# EAGLE design pcb_transformer_test (EAGLE 9.2.2)
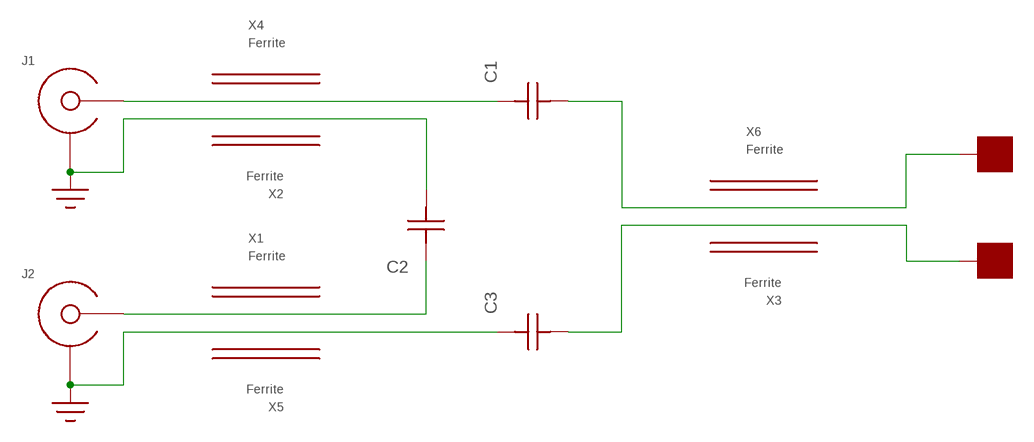
[diagram p0: schematic, sheet 1]

## Parts
C1  C0603  [C0603]
C2  C0603  [C0603]
C3  C0603  [C0603]
J1  EDGE_LAUNCH_JACK  [EDGE_LAUNCH_RF_CON]
J2  EDGE_LAUNCH_JACK  [EDGE_LAUNCH_RF_CON]
U$2  PAD50MIL  [PAD_50MIL]
U$5  PAD50MIL  [PAD_50MIL]
X1  Ferrite  FERRITE_PLATE  [FERRITE-MP0350]
X2  Ferrite  FERRITE_PLATE  [FERRITE-MP0350]
X3  Ferrite  FERRITE_PLATE  [FERRITE-MP0350]
X4  Ferrite  FERRITE_PLATE  [FERRITE-MP0350]
X5  Ferrite  FERRITE_PLATE  [FERRITE-MP0350]
X6  Ferrite  FERRITE_PLATE  [FERRITE-MP0350]

## Nets
GND: C2.P$1 C3.P$2 J1.GND@1(SHIELD) J1.GND@2(SHIELD) J1.GND@3(SHIELD) J1.GND@4(SHIELD) J1.GND@5(SHIELD) J1.GND@6(SHIELD) J1.GND@7(SHIELD) J1.GND@8(SHIELD) J1.GND@9(SHIELD) J1.GND@10(SHIELD) J1.GND@11(SHIELD) J1.GND@12(SHIELD) J1.SHIELD@1(SHIELD) J1.SHIELD@2(SHIELD) J2.GND@1(SHIELD) J2.GND@2(SHIELD) J2.GND@3(SHIELD) J2.GND@4(SHIELD) J2.GND@5(SHIELD) J2.GND@6(SHIELD) J2.GND@7(SHIELD) J2.GND@8(SHIELD) J2.GND@9(SHIELD) J2.GND@10(SHIELD) J2.GND@11(SHIELD) J2.GND@12(SHIELD) J2.SHIELD@1(SHIELD) J2.SHIELD@2(SHIELD)
N$1: C1.P$2 J1.CENTER
N$2: C2.P$2 J2.CENTER
N$3: C1.P$1 U$2.P$1
N$4: C3.P$1 U$5.P$1

## Library data of the parts
C1-C3 = yapo:C
J1 J2 = yapo:EDGE_LAUNCH_JACK
U$2 U$5 = yapo:PAD
X1-X6 = yapo:FERRITE_PLATE

## Board
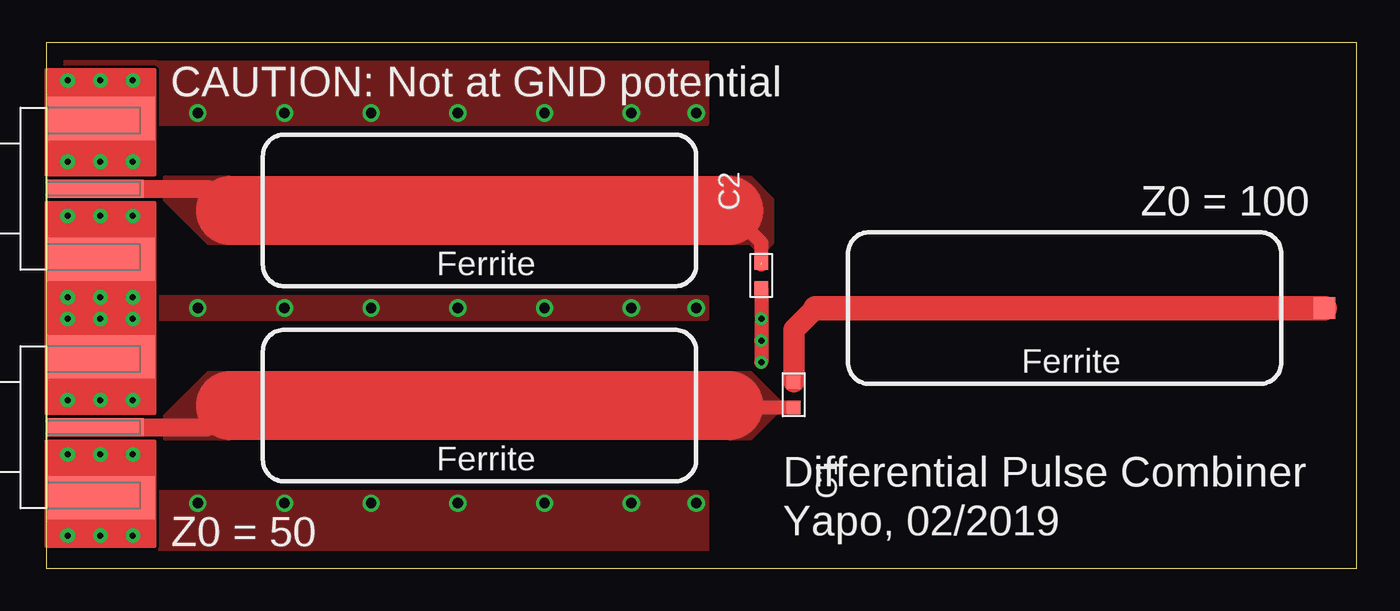
[diagram p1: board, top side]
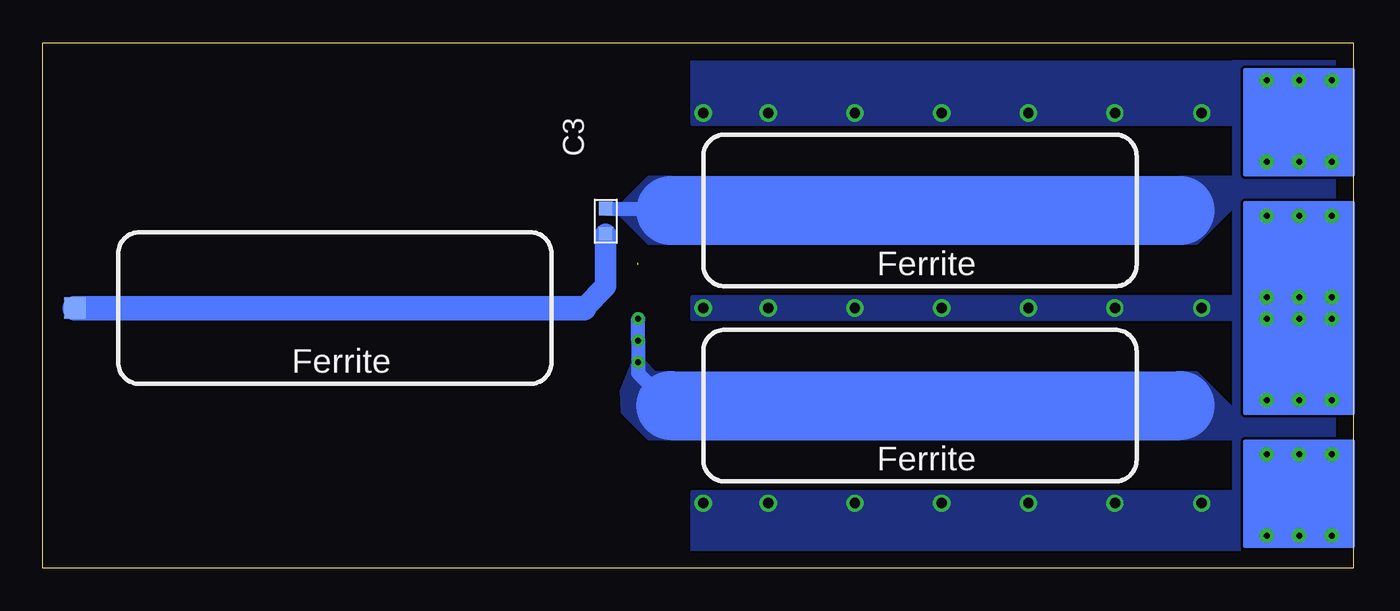
[diagram p2: board, bottom side, seen from below]

Size 76.81 x 30.79 mm. Coordinates in mm from the lower left corner, seen from the top.
Outline: 0,0 76.81,0 76.81,30.79 0,30.79 0,0
Copper layers (1*16): Top 0.035mm / dielectric 1.5mm / Bottom 0.035mm
Design rules "default": minimum track width 6mil, minimum drill 0.35mm, track to track 6mil, track to pad 6mil, pad to pad 6mil, via to via 6mil, smd to smd 6mil, copper to edge 40mil, drill to drill 6mil, minimum pad ring 10mil, minimum via ring 8mil, stop-mask expansion 4mil, vias tented up to drill 0mil, thermal gap 10mil

### Footprints (pad centres in the part's own frame; a part is rotated, then mirrored left to right if it is on the bottom)
C0603 = smd 0.8 x 0.8: P$1 -0.75,0; P$2 0.75,0
EDGE_LAUNCH_RF_CON = smd 5.715 x 1.041: CENTER -2.875,0 | drill 0.35: GND@1 -5.08,1.587; GND@2 -3.175,1.587; GND@3 -1.27,1.587; GND@4 -5.08,-1.587; GND@5 -3.175,-1.587; GND@6 -1.27,-1.587; GND@7 -5.08,6.35; GND@8 -3.175,6.35; GND@9 -1.27,6.35; GND@10 -5.08,-6.35; GND@11 -3.175,-6.35; GND@12 -1.27,-6.35 | smd 6.35 x 2.54: SHIELD@1 -3.175,-4.128; SHIELD@2 -3.175,4.128
PAD_50MIL = smd 1.27 x 1.27: P$1 0,0

### Placement (x,y rotation side)
C1  43.81,10.16 270 top
C2  41.91,17.14 90 top
C3  43.81,20.32 90 bottom
J1  0,8.26 180 top
J2  0,22.23 180 top
U$2  74.93,15.24 0 top
U$5  74.93,15.24 0 bottom
X1  25.4,20.95 0 top
X2  25.4,9.53 0 top
X3  25.4,9.53 0 bottom
X4  25.4,20.95 0 bottom
X5  59.69,15.24 0 top
X6  59.69,15.24 0 bottom

### Tracks (layer width: path | path; a pad name or v marks a point on that pad's centre or on a via)
GND  (via drill 0.35, 0.6)
  Top 0.813: C2.P$1 v41.91,13.34 v41.91,12.06
  Bottom 0.813: C3.P$2 40.12,21.07 40.01,20.95 | 40.01,9.53 41.91,11.43 v41.91,13.34 v41.91,14.61
  Bottom 4.039: 40.01,9.53 10.16,9.53 | 40.01,20.95 10.16,20.95
  other vias: 8.89,15.24 8.89,26.67 8.89,3.81 13.97,3.81 19.05,3.81 24.13,3.81 29.21,3.81 34.29,3.81 13.97,15.24 19.05,15.24 24.13,15.24 29.21,15.24 34.29,15.24 13.97,26.67 19.05,26.67 24.13,26.67 29.21,26.67 34.29,26.67 38.1,26.67 38.1,15.24 38.1,3.81
  pour Bottom: 0,30.48 6.99,30.48 6.99,0 0,0
  pour Bottom: 40.01,22.86 41.27,22.86 43.18,20.95 41.27,19.05 40.01,19.05
  pour Top: 0,0 6.35,0 6.35,30.48 0,30.48
  pour Top: 0.64,15.88 38.73,15.88 38.73,14.61 0.64,14.61
  pour Bottom: 38.73,15.88 1.27,15.88 1.27,14.61 38.73,14.61
  pour Bottom: 38.73,4.45 1.27,4.45 1.27,0.64 38.73,0.64
  pour Bottom: 38.73,29.84 1.27,29.84 1.27,26.04 38.73,26.04
  pour Top: 0.64,29.84 38.73,29.84 38.73,26.04 0.64,26.04
  pour Top: 0.64,4.45 38.73,4.45 38.73,0.64 0.64,0.64
  pour Bottom: 10.16,22.86 6.35,22.86 6.35,21.91 9.21,19.05 10.16,19.05
  pour Bottom: 10.16,11.43 9.21,11.43 6.35,8.57 6.35,7.62 10.16,7.62
  pour Bottom: 40.01,11.43 40.96,11.43 41.67,12.14 42.23,11.96 42.86,10.37 42.8,9.15 41.27,7.62 40.01,7.62
N$1
  Top 0.254: 9.53,8.26 10.79,9.53
  Top 0.813: C1.P$2 40.52,9.41 40.01,8.89 40.01,9.53
  Top 1.041: J1.CENTER 9.53,8.26
  Top 4.039: 40.01,9.53 10.79,9.53
  pour Top: 6.99,7.62 10.79,7.62 10.79,11.43 9.53,11.43 6.99,8.89
  pour Top: 40.01,11.43 41.27,11.43 43.18,9.53 41.27,7.62 40.01,7.62
N$2  (1 unrouted)
  Top 0.254: 9.53,22.23 10.79,20.95
  Top 0.813: 41.91,17.78 41.91,19.05 40.01,20.95
  Top 1.041: J2.CENTER 9.53,22.23
  Top 4.039: 10.79,20.95 40.01,20.95
  pour Top: 6.99,22.86 10.79,22.86 10.79,19.05 9.53,19.05 6.99,21.59
  pour Top: 40.01,22.86 41.27,22.86 42.55,21.59 42.55,19.05 41.91,18.41 41.27,19.05 40.01,19.05
N$3
  Top 1.27: C1.P$1 43.81,13.97 45.09,15.24
  Top 1.448: 45.09,15.24 U$2.P$1
N$4
  Bottom 1.27: 45.09,15.24 43.81,16.51 C3.P$1
  Bottom 1.448: U$5.P$1 45.09,15.24

### Text on the board
tPlace: CAUTION: Not at GND potential | Z0 = 100 | Differential Pulse Combiner | Yapo, 02/2019 | Z0 = 50